# EAGLE schematic cpu-68000 (EAGLE 9.5.2)

## Sheet 1 of 4: CPU
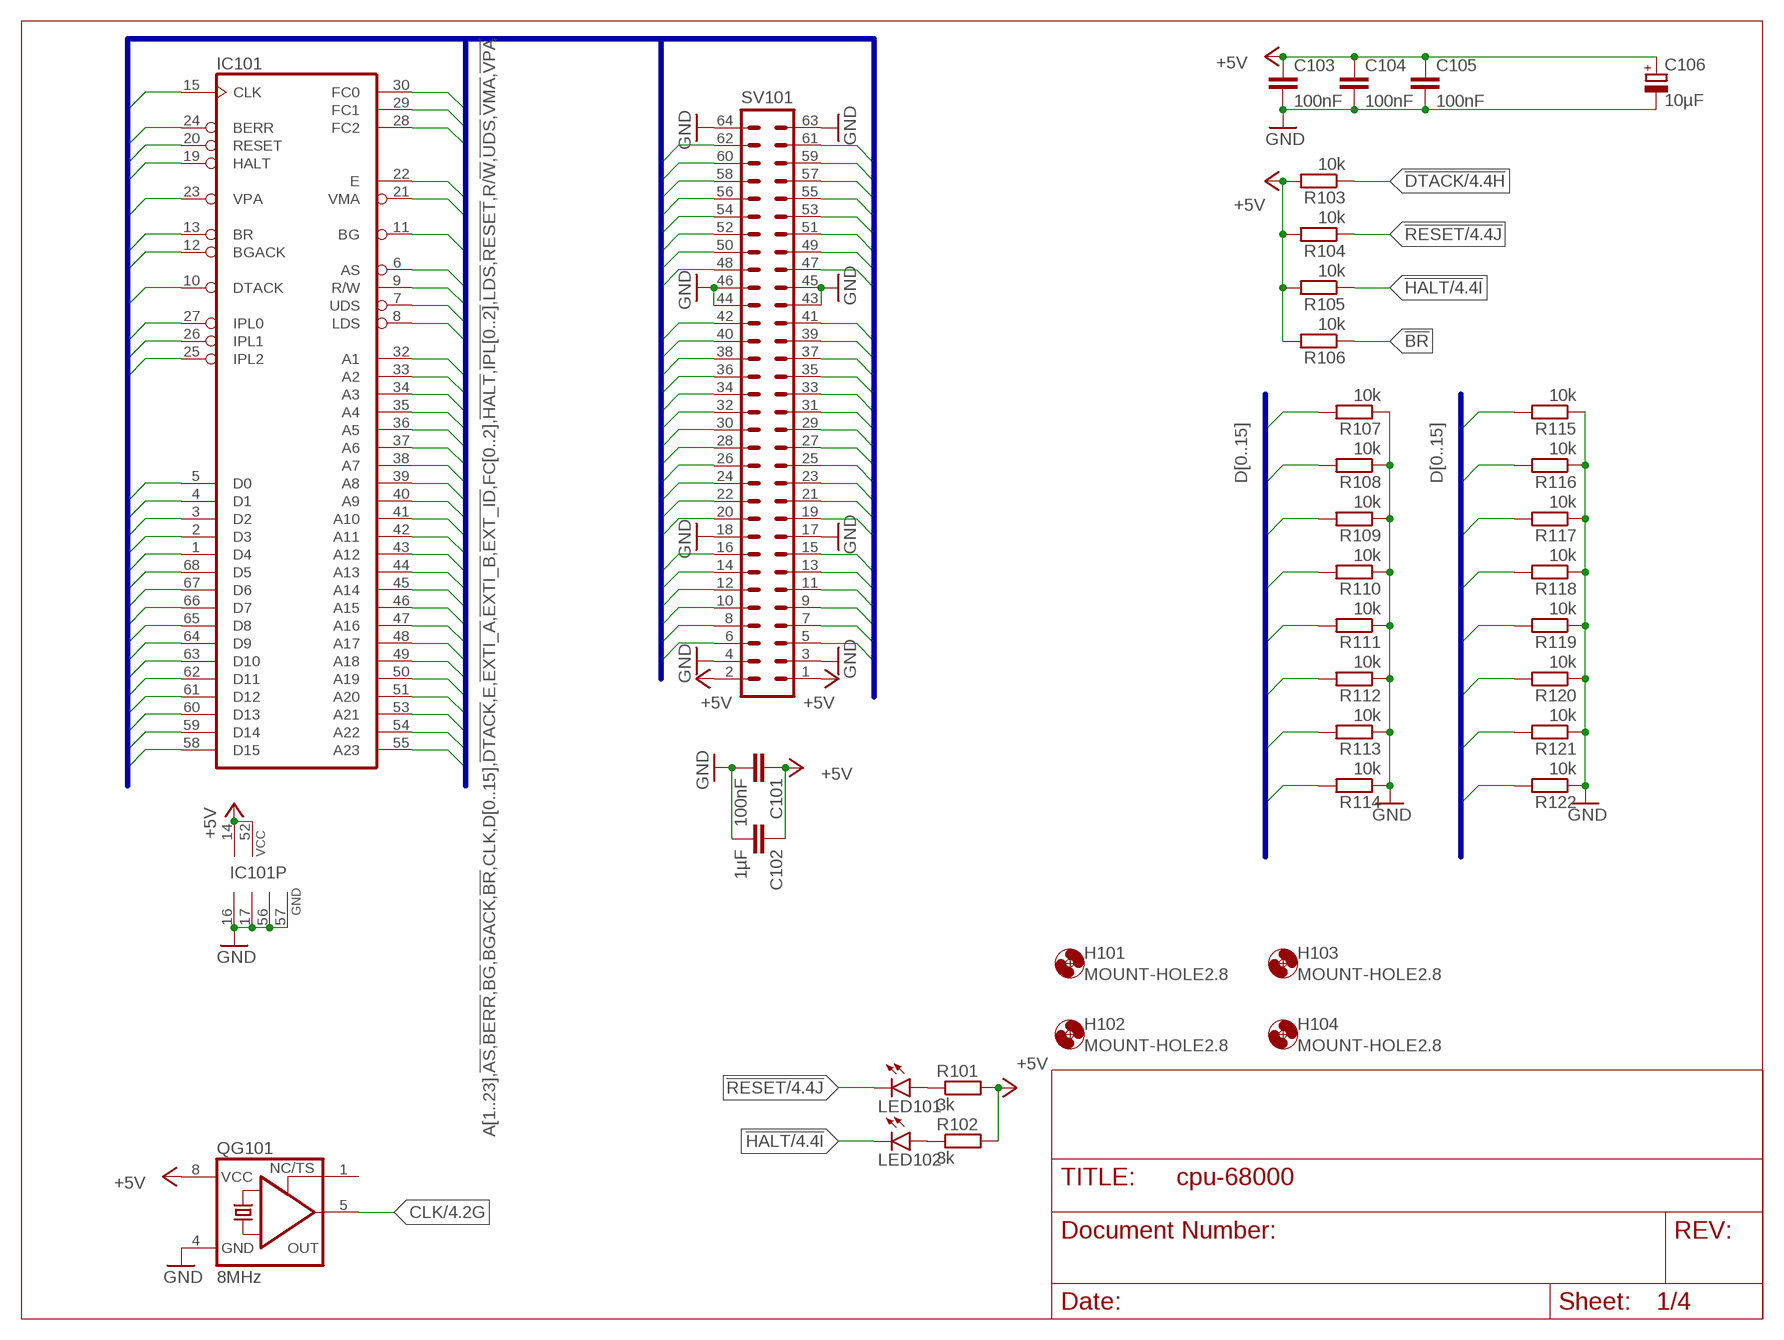
[diagram p0: schematic, sheet 1]

### Parts
C101  100nF  C-EUC0805  [C0805]
C102  1µF  C-EUC0805  [C0805]
C103  100nF  C-EUC0805  [C0805]
C104  100nF  C-EUC0805  [C0805]
C105  100nF  C-EUC0805  [C0805]
C106  10µF  CPOL-EUSMCB  [SMC_B]
H101  MOUNT-HOLE2.8  [2,8]
H102  MOUNT-HOLE2.8  [2,8]
H103  MOUNT-HOLE2.8  [2,8]
H104  MOUNT-HOLE2.8  [2,8]
IC101  MC68000FN-SOC  [PLCC68SOCK]
LED101  LEDCHIPLED_1206  [CHIPLED_1206]
LED102  LEDCHIPLED_1206  [CHIPLED_1206]
QG101  8MHz  XO-8  [DIL08S]
R101  3k  R-EU_R2012  [R2012]
R102  3k  R-EU_R2012  [R2012]
R103  10k  R-EU_R2012  [R2012]
R104  10k  R-EU_R2012  [R2012]
R105  10k  R-EU_R2012  [R2012]
R106  10k  R-EU_R2012  [R2012]
R107  10k  R-EU_R2012  [R2012]
R108  10k  R-EU_R2012  [R2012]
R109  10k  R-EU_R2012  [R2012]
R110  10k  R-EU_R2012  [R2012]
R111  10k  R-EU_R2012  [R2012]
R112  10k  R-EU_R2012  [R2012]
R113  10k  R-EU_R2012  [R2012]
R114  10k  R-EU_R2012  [R2012]
R115  10k  R-EU_R2012  [R2012]
R116  10k  R-EU_R2012  [R2012]
R117  10k  R-EU_R2012  [R2012]
R118  10k  R-EU_R2012  [R2012]
R119  10k  R-EU_R2012  [R2012]
R120  10k  R-EU_R2012  [R2012]
R121  10k  R-EU_R2012  [R2012]
R122  10k  R-EU_R2012  [R2012]
SV101  ML64L  [ML64L]

### Nets
!AS: IC101.6(AS) SV101.13 ; also sheet 4
!BERR: IC101.24(BERR) ; also sheet 4
!BG: IC101.11(BG) SV101.9
!BGACK: IC101.12(BGACK) SV101.8
!BR: IC101.13(BR) R106.1 SV101.7
!DTACK: IC101.10(DTACK) R103.1 SV101.10 ; also sheet 3,4
!EXT_ID: SV101.41 ; also sheet 3
!EXTI_A: SV101.16 ; also sheet 4
!EXTI_B: SV101.15 ; also sheet 4
!HALT: IC101.19(HALT) LED102.C R105.1 SV101.5 ; also sheet 4
!IPL0: IC101.27(IPL0) ; also sheet 4
!IPL1: IC101.26(IPL1) ; also sheet 4
!IPL2: IC101.25(IPL2) ; also sheet 4
!LDS: IC101.8(LDS) SV101.11 ; also sheet 4
!RESET: IC101.20(RESET) LED101.C R104.1 SV101.6 ; also sheet 3,4
!UDS: IC101.7(UDS) SV101.14 ; also sheet 4
!VMA: IC101.21(VMA)
!VPA: IC101.23(VPA) ; also sheet 4
+5V: C101.1 C102.1 C103.1 C104.1 C105.1 C106.+ IC101.14(VCC) IC101.52(VCC) QG101.8(VCC) R101.2 R102.2 R103.2 R104.2 R105.2 R106.2 SV101.1 SV101.2 ; also sheet 2,3,4
A1: IC101.32(A1) SV101.20 ; also sheet 2,3
A2: IC101.33(A2) SV101.22 ; also sheet 2,3
A3: IC101.34(A3) SV101.19 ; also sheet 2,3
A4: IC101.35(A4) SV101.24 ; also sheet 2,3
A5: IC101.36(A5) SV101.21 ; also sheet 2,3
A6: IC101.37(A6) SV101.23 ; also sheet 2,3
A7: IC101.38(A7) SV101.26 ; also sheet 2,3
A8: IC101.39(A8) SV101.25 ; also sheet 2,3
A9: IC101.40(A9) SV101.28 ; also sheet 2,3
A10: IC101.41(A10) SV101.27 ; also sheet 2,3
A11: IC101.42(A11) SV101.30 ; also sheet 2,3
A12: IC101.43(A12) SV101.29 ; also sheet 2,3
A13: IC101.44(A13) SV101.31 ; also sheet 2,3
A14: IC101.45(A14) SV101.32 ; also sheet 2,3
A15: IC101.46(A15) SV101.33 ; also sheet 2,3,4
A16: IC101.47(A16) SV101.34 ; also sheet 2
A17: IC101.48(A17) SV101.36 ; also sheet 2
A18: IC101.49(A18) SV101.35 ; also sheet 2
A19: IC101.50(A19) SV101.38 ; also sheet 2,4
A20: IC101.51(A20) SV101.37 ; also sheet 4
A21: IC101.53(A21) SV101.40 ; also sheet 4
A22: IC101.54(A22) SV101.39 ; also sheet 4
A23: IC101.55(A23) SV101.42 ; also sheet 4
CLK: IC101.15(CLK) QG101.5(OUT) ; also sheet 4
D0: IC101.5(D0) R107.2 SV101.62 ; also sheet 2,3
D1: IC101.4(D1) R108.2 SV101.60 ; also sheet 2,3
D2: IC101.3(D2) R109.2 SV101.58 ; also sheet 2,3
D3: IC101.2(D3) R110.2 SV101.56 ; also sheet 2,3
D4: IC101.1(D4) R111.2 SV101.54 ; also sheet 2,3
D5: IC101.68(D5) R112.2 SV101.52 ; also sheet 2,3
D6: IC101.67(D6) R113.2 SV101.50 ; also sheet 2,3
D7: IC101.66(D7) R114.2 SV101.48 ; also sheet 2,3
D8: IC101.65(D8) R115.2 SV101.57 ; also sheet 2
D9: IC101.64(D9) R116.2 SV101.59 ; also sheet 2
D10: IC101.63(D10) R117.2 SV101.61 ; also sheet 2
D11: IC101.62(D11) R118.2 SV101.55 ; also sheet 2
D12: IC101.61(D12) R119.2 SV101.53 ; also sheet 2
D13: IC101.60(D13) R120.2 SV101.51 ; also sheet 2
D14: IC101.59(D14) R121.2 SV101.49 ; also sheet 2
D15: IC101.58(D15) R122.2 SV101.47 ; also sheet 2
E: IC101.22(E) ; also sheet 4
FC0: IC101.30(FC0) ; also sheet 4
FC1: IC101.29(FC1) ; also sheet 4
FC2: IC101.28(FC2) ; also sheet 4
GND: C101.2 C102.2 C103.2 C104.2 C105.2 C106.- IC101.16(GND) IC101.17(GND) IC101.56(GND) IC101.57(GND) QG101.4(GND) R107.1 R108.1 R109.1 R110.1 R111.1 R112.1 R113.1 R114.1 R115.1 R116.1 R117.1 R118.1 R119.1 R120.1 R121.1 R122.1 SV101.3 SV101.4 SV101.17 SV101.18 SV101.43 SV101.44 SV101.45 SV101.46 SV101.63 SV101.64 ; also sheet 2,3,4
N$18: LED101.A R101.1
N$19: LED102.A R102.1
R/!W!: IC101.9(R/W) SV101.12 ; also sheet 4
Unconnected: QG101.1(TS)

### Buses
A[1..23],!AS,!BERR,!BG,!BGACK,!BR,CLK,D[0..15],!DTACK,E,!EXTI_A,!EXTI_B,!EXT_ID,FC[0..2],!HALT,!IPL[0..2],!LDS,!RESET,R/!W!,!UDS,!VMA,!VPA
D[0..15]

## Sheet 2 of 4: RAM, ROM
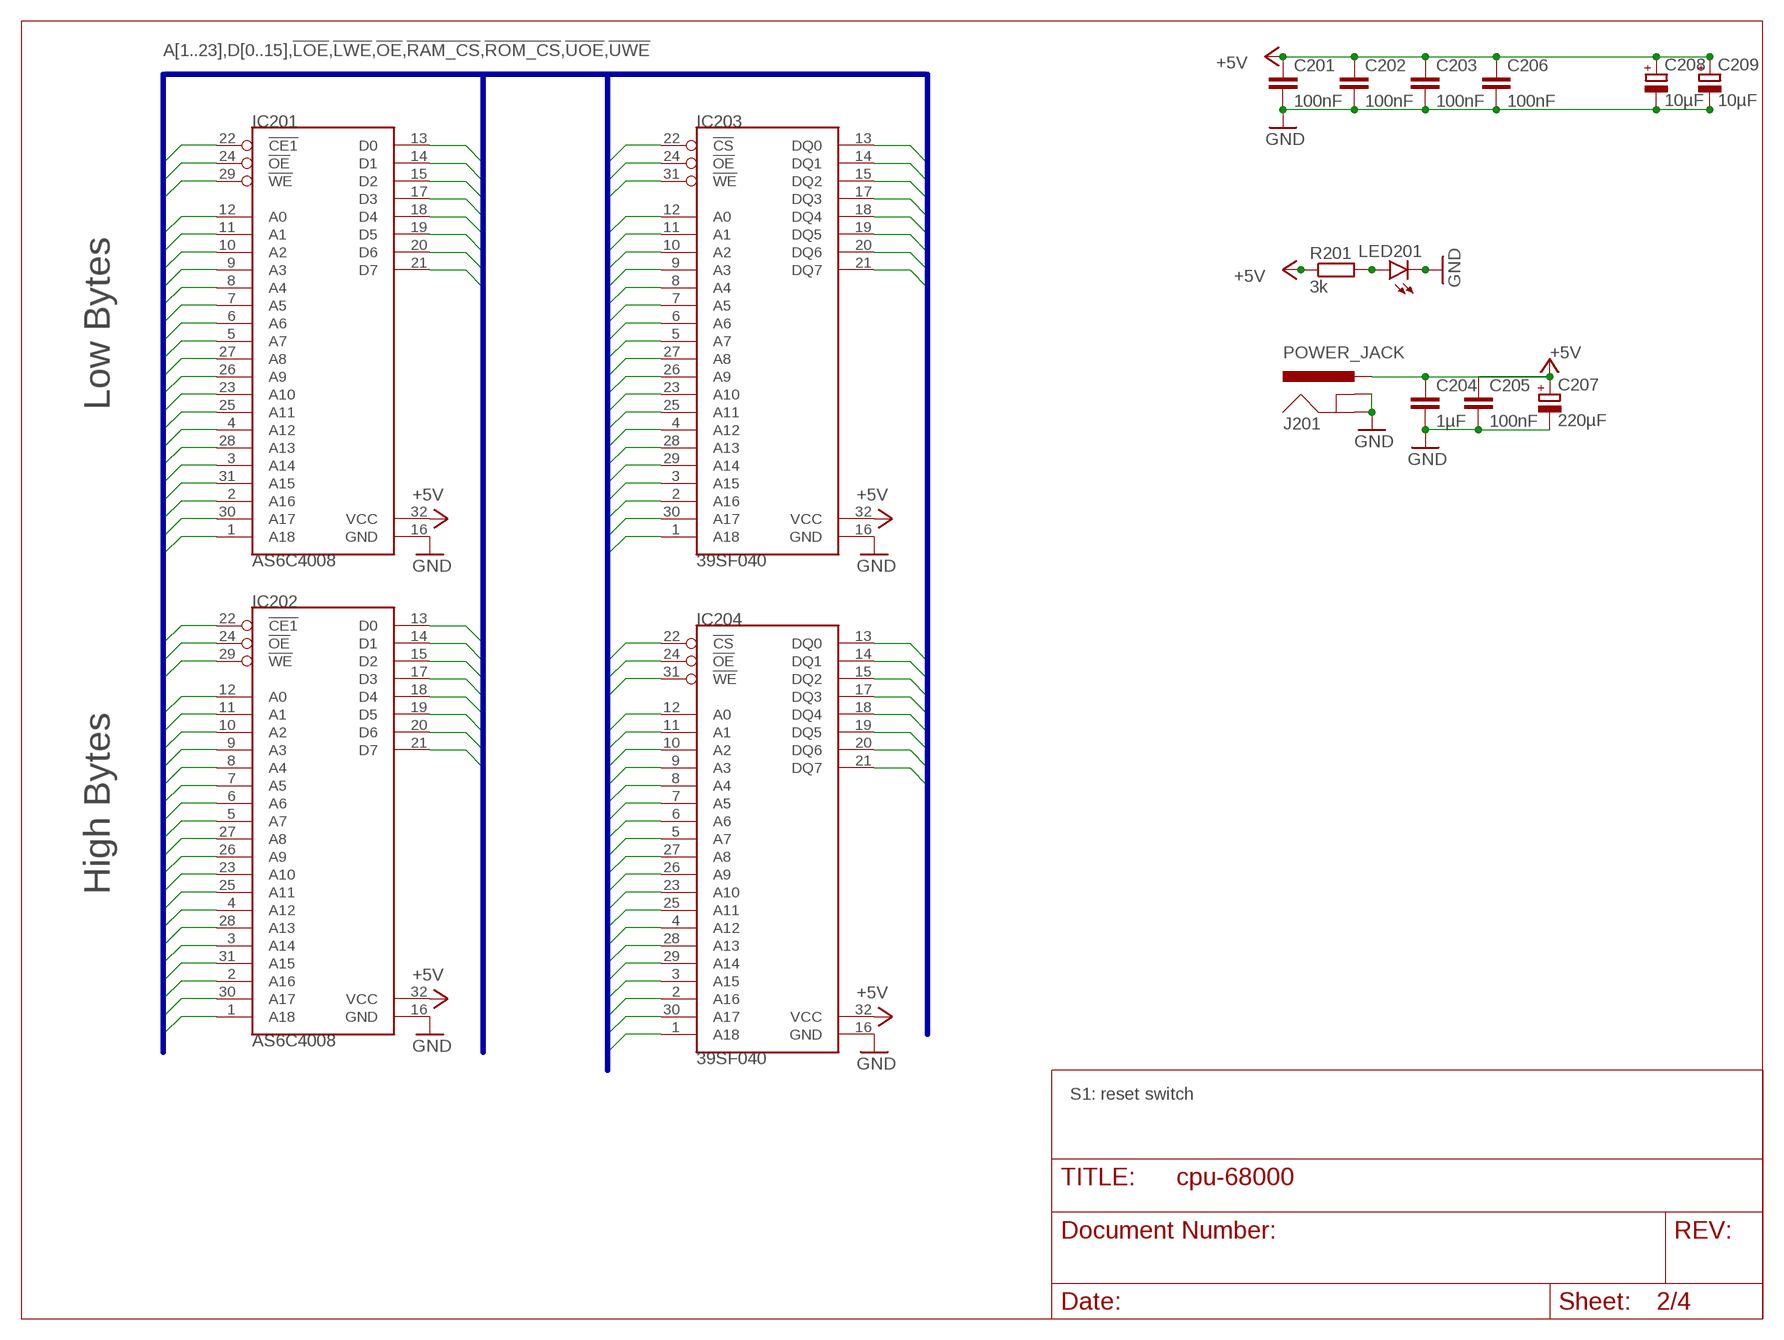
[diagram p1: schematic, sheet 2]

### Parts
C201  100nF  C-EUC0805  [C0805]
C202  100nF  C-EUC0805  [C0805]
C203  100nF  C-EUC0805  [C0805]
C204  1µF  C-EUC0805  [C0805]
C205  100nF  C-EUC0805  [C0805]
C206  100nF  C-EUC0805  [C0805]
C207  220µF  CPOL-EUE2.5-7  [E2,5-7]
C208  10µF  CPOL-EUSMCB  [SMC_B]
C209  10µF  CPOL-EUSMCB  [SMC_B]
IC201  AS6C4008  [DIL32]
IC202  AS6C4008  [DIL32]
IC203  39SF040  SST39SF0X0PDIP32  [DIL32]
IC204  39SF040  SST39SF0X0PDIP32  [DIL32]
J201  POWER_JACK  [POWER_JACK_PTH]
LED201  LEDCHIPLED_1206  [CHIPLED_1206]
R201  3k  R-EU_R2012  [R2012]

### Nets
!LOE: IC201.24(!OE) IC203.24(!OE) ; also sheet 3,4
!LWE: IC201.29(!WE) IC203.31(!WE) ; also sheet 3,4
!RAM_CS: IC201.22(!CE1) IC202.22(!CE1) ; also sheet 4
!ROM_CS: IC203.22(!CS) IC204.22(!CS) ; also sheet 4
!UOE: IC202.24(!OE) IC204.24(!OE) ; also sheet 4
!UWE: IC202.29(!WE) IC204.31(!WE) ; also sheet 4
+5V: C201.1 C202.1 C203.1 C204.1 C205.1 C206.1 C207.+ C208.+ C209.+ IC201.32(VCC) IC202.32(VCC) IC203.32(VCC) IC204.32(VCC) J201.PWR R201.1 ; also sheet 1,3,4
A1: IC201.12(A0) IC202.12(A0) IC203.12(A0) IC204.12(A0) ; also sheet 1,3
A2: IC201.11(A1) IC202.11(A1) IC203.11(A1) IC204.11(A1) ; also sheet 1,3
A3: IC201.10(A2) IC202.10(A2) IC203.10(A2) IC204.10(A2) ; also sheet 1,3
A4: IC201.9(A3) IC202.9(A3) IC203.9(A3) IC204.9(A3) ; also sheet 1,3
A5: IC201.8(A4) IC202.8(A4) IC203.8(A4) IC204.8(A4) ; also sheet 1,3
A6: IC201.7(A5) IC202.7(A5) IC203.7(A5) IC204.7(A5) ; also sheet 1,3
A7: IC201.6(A6) IC202.6(A6) IC203.6(A6) IC204.6(A6) ; also sheet 1,3
A8: IC201.5(A7) IC202.5(A7) IC203.5(A7) IC204.5(A7) ; also sheet 1,3
A9: IC201.27(A8) IC202.27(A8) IC203.27(A8) IC204.27(A8) ; also sheet 1,3
A10: IC201.26(A9) IC202.26(A9) IC203.26(A9) IC204.26(A9) ; also sheet 1,3
A11: IC201.23(A10) IC202.23(A10) IC203.23(A10) IC204.23(A10) ; also sheet 1,3
A12: IC201.25(A11) IC202.25(A11) IC203.25(A11) IC204.25(A11) ; also sheet 1,3
A13: IC201.4(A12) IC202.4(A12) IC203.4(A12) IC204.4(A12) ; also sheet 1,3
A14: IC201.28(A13) IC202.28(A13) IC203.28(A13) IC204.28(A13) ; also sheet 1,3
A15: IC201.3(A14) IC202.3(A14) IC203.29(A14) IC204.29(A14) ; also sheet 1,3,4
A16: IC201.31(A15) IC202.31(A15) IC203.3(A15) IC204.3(A15) ; also sheet 1
A17: IC201.2(A16) IC202.2(A16) IC203.2(A16) IC204.2(A16) ; also sheet 1
A18: IC201.30(A17) IC202.30(A17) IC203.30(A17) IC204.30(A17) ; also sheet 1
A19: IC201.1(A18) IC202.1(A18) IC203.1(A18) IC204.1(A18) ; also sheet 1,4
D0: IC201.13(D0) IC203.13(DQ0) ; also sheet 1,3
D1: IC201.14(D1) IC203.14(DQ1) ; also sheet 1,3
D2: IC201.15(D2) IC203.15(DQ2) ; also sheet 1,3
D3: IC201.17(D3) IC203.17(DQ3) ; also sheet 1,3
D4: IC201.18(D4) IC203.18(DQ4) ; also sheet 1,3
D5: IC201.19(D5) IC203.19(DQ5) ; also sheet 1,3
D6: IC201.20(D6) IC203.20(DQ6) ; also sheet 1,3
D7: IC201.21(D7) IC203.21(DQ7) ; also sheet 1,3
D8: IC202.13(D0) IC204.13(DQ0) ; also sheet 1
D9: IC202.14(D1) IC204.14(DQ1) ; also sheet 1
D10: IC202.15(D2) IC204.15(DQ2) ; also sheet 1
D11: IC202.17(D3) IC204.17(DQ3) ; also sheet 1
D12: IC202.18(D4) IC204.18(DQ4) ; also sheet 1
D13: IC202.19(D5) IC204.19(DQ5) ; also sheet 1
D14: IC202.20(D6) IC204.20(DQ6) ; also sheet 1
D15: IC202.21(D7) IC204.21(DQ7) ; also sheet 1
GND: C201.2 C202.2 C203.2 C204.2 C205.2 C206.2 C207.- C208.- C209.- IC201.16(GND) IC202.16(GND) IC203.16(GND) IC204.16(GND) J201.GND J201.GNDBREAK LED201.C ; also sheet 1,3,4
N$4: LED201.A R201.2

### Buses
A[1..23],D[0..15],!LOE,!LWE,!OE,!RAM_CS,!ROM_CS,!UOE,!UWE

### Notes on the sheet
- Low Bytes
- High Bytes
- S1: reset switch

## Sheet 3 of 4: Peripherals (DUART, RTC)
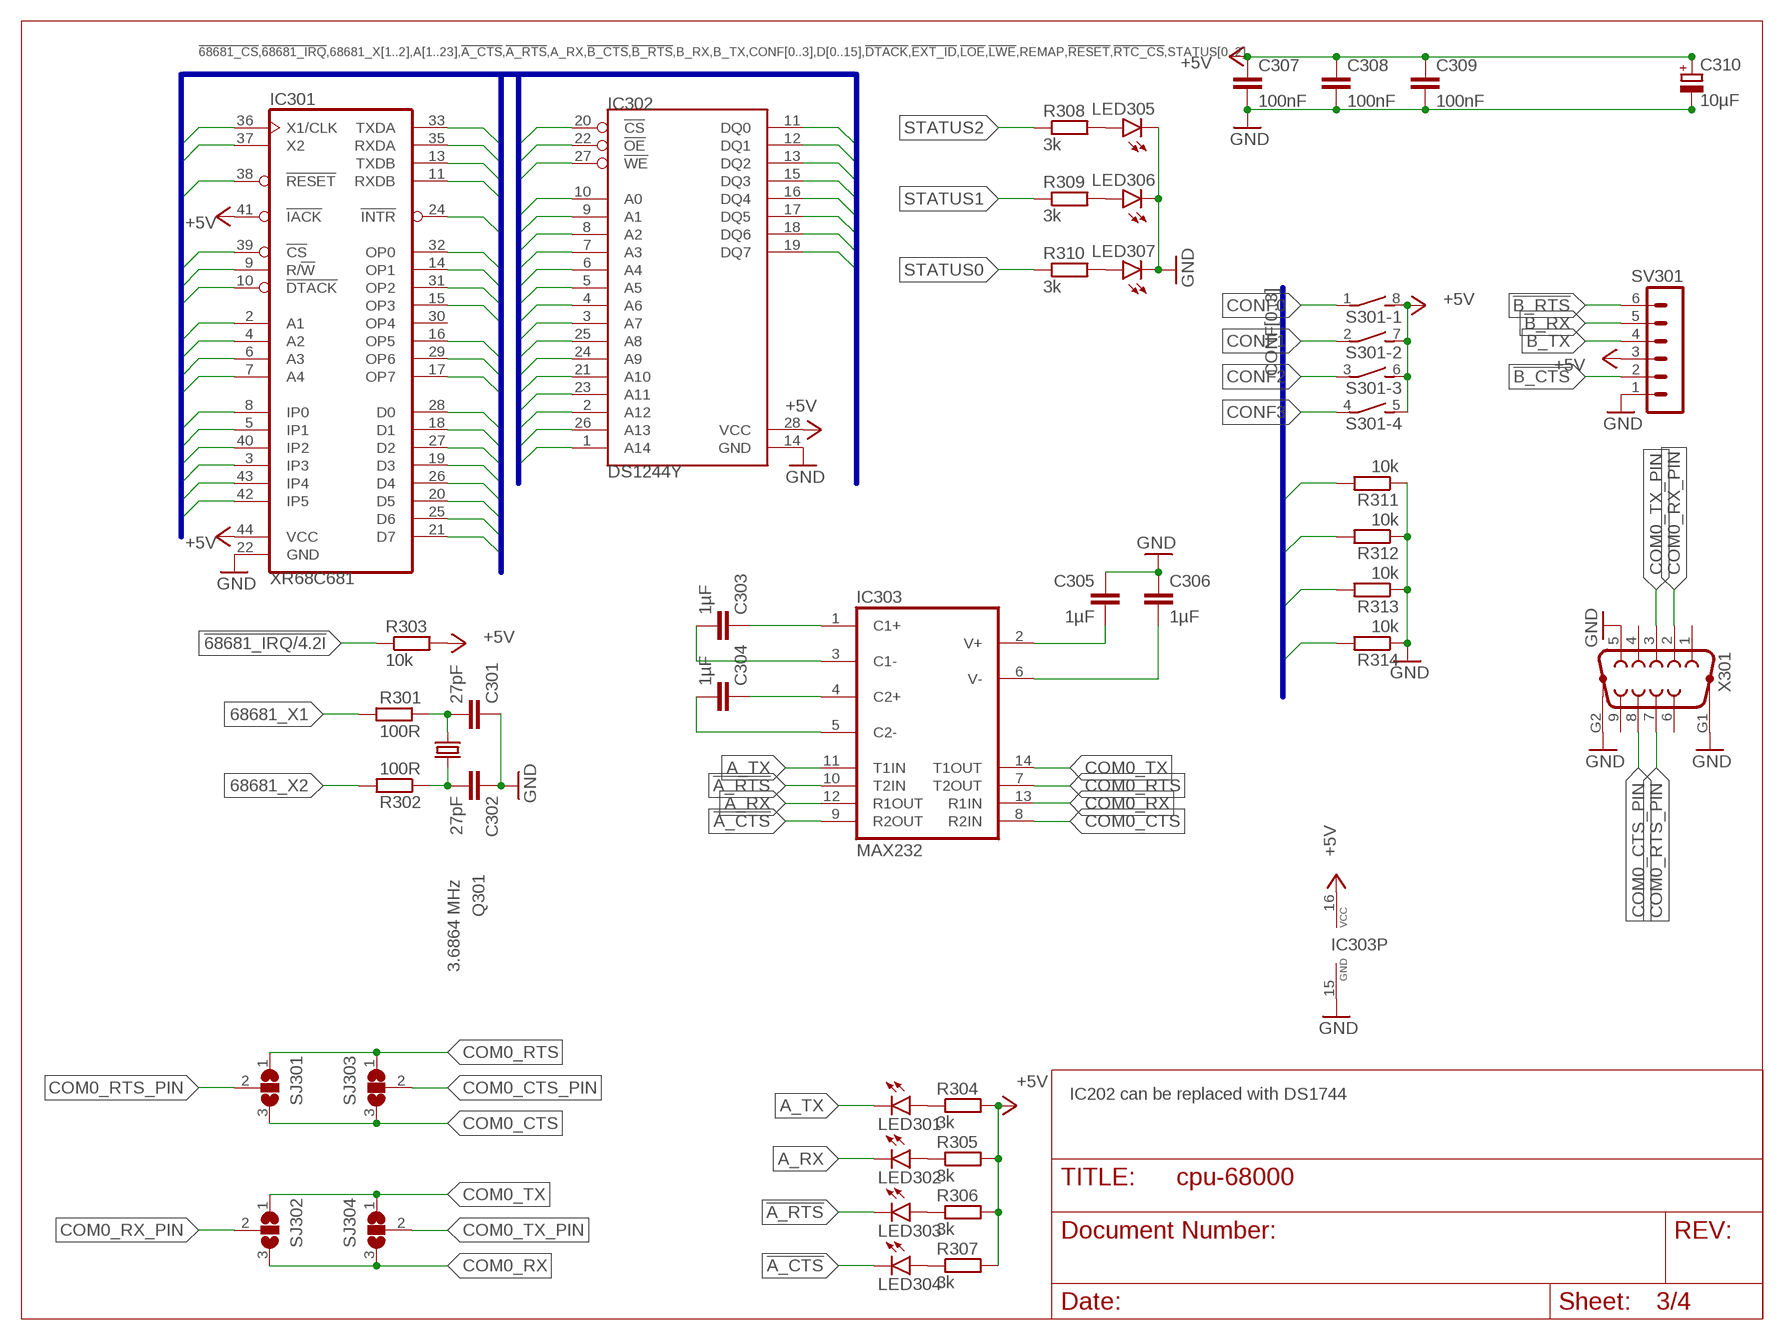
[diagram p2: schematic, sheet 3]

### Parts
C301  27pF  C-EUC0805  [C0805]
C302  27pF  C-EUC0805  [C0805]
C303  1µF  C-EUC0805  [C0805]
C304  1µF  C-EUC0805  [C0805]
C305  1µF  C-EUC0805  [C0805]
C306  1µF  C-EUC0805  [C0805]
C307  100nF  C-EUC0805  [C0805]
C308  100nF  C-EUC0805  [C0805]
C309  100nF  C-EUC0805  [C0805]
C310  10µF  CPOL-EUSMCB  [SMC_B]
IC301  XR68C681  MC68681PLCC44-SOCKET  [PLCC-S44]
IC302  DS1244Y  DS1244EDIP-28  [DIL28-6]
IC303  MAX232  [DIL16]
LED301  LEDCHIPLED_1206  [CHIPLED_1206]
LED302  LEDCHIPLED_1206  [CHIPLED_1206]
LED303  LEDCHIPLED_1206  [CHIPLED_1206]
LED304  LEDCHIPLED_1206  [CHIPLED_1206]
LED305  LEDCHIPLED_1206  [CHIPLED_1206]
LED306  LEDCHIPLED_1206  [CHIPLED_1206]
LED307  LEDCHIPLED_1206  [CHIPLED_1206]
Q301  3.6864 MHz  CRYSTALHC49S  [HC49/S]
R301  100R  R-EU_R2012  [R2012]
R302  100R  R-EU_R2012  [R2012]
R303  10k  R-EU_R2012  [R2012]
R304  3k  R-EU_R2012  [R2012]
R305  3k  R-EU_R2012  [R2012]
R306  3k  R-EU_R2012  [R2012]
R307  3k  R-EU_R2012  [R2012]
R308  3k  R-EU_R2012  [R2012]
R309  3k  R-EU_R2012  [R2012]
R310  3k  R-EU_R2012  [R2012]
R311  10k  R-EU_R2012  [R2012]
R312  10k  R-EU_R2012  [R2012]
R313  10k  R-EU_R2012  [R2012]
R314  10k  R-EU_R2012  [R2012]
S301  DIP04S  [DIP04S]
SJ301  SJ2WW  [SJ_2W]
SJ302  SJ2WW  [SJ_2W]
SJ303  SJ2WW  [SJ_2W]
SJ304  SJ2WW  [SJ_2W]
SV301  MA06-1  [MA06-1]
X301  F09HP  [F09HP]

### Nets
68681_X1: IC301.36(X1/CLK) R301.2
68681_X2: IC301.37(X2) R302.2
!68681_CS: IC301.39(!CS) ; also sheet 4
!68681_IRQ: IC301.24(!INTR) R303.1 ; also sheet 4
!A_CTS: IC301.8(IP0) IC303.9(R2OUT) LED304.C
!A_RTS: IC301.32(OP0) IC303.10(T2IN) LED303.C
!B_CTS: IC301.5(IP1) SV301.2
!B_RTS: IC301.14(OP1) SV301.6
!DTACK: IC301.10(!DTACK) ; also sheet 1,4
!EXT_ID: IC301.29(OP6) ; also sheet 1
!LOE: IC302.22(!OE) ; also sheet 2,4
!LWE: IC301.9(R/!W) IC302.27(!WE) ; also sheet 2,4
!RESET: IC301.38(!RESET) ; also sheet 1,4
!RTC_CS: IC302.20(!CS) ; also sheet 4
+5V: C307.1 C308.1 C309.1 C310.+ IC301.41(!IACK) IC301.44(VCC) IC302.28(VCC) IC303.16(VCC) R303.2 R304.2 R305.2 R306.2 R307.2 S301.5 S301.6 S301.7 S301.8 SV301.3 ; also sheet 1,2,4
A1: IC301.2(A1) IC302.10(A0) ; also sheet 1,2
A2: IC301.4(A2) IC302.9(A1) ; also sheet 1,2
A3: IC301.6(A3) IC302.8(A2) ; also sheet 1,2
A4: IC301.7(A4) IC302.7(A3) ; also sheet 1,2
A5: IC302.6(A4) ; also sheet 1,2
A6: IC302.5(A5) ; also sheet 1,2
A7: IC302.4(A6) ; also sheet 1,2
A8: IC302.3(A7) ; also sheet 1,2
A9: IC302.25(A8) ; also sheet 1,2
A10: IC302.24(A9) ; also sheet 1,2
A11: IC302.21(A10) ; also sheet 1,2
A12: IC302.23(A11) ; also sheet 1,2
A13: IC302.2(A12) ; also sheet 1,2
A14: IC302.26(A13) ; also sheet 1,2
A15: IC302.1(A14) ; also sheet 1,2,4
A_RX: IC301.35(RXDA) IC303.12(R1OUT) LED302.C
A_TX: IC301.33(TXDA) IC303.11(T1IN) LED301.C
B_RX: IC301.11(RXDB) SV301.5
B_TX: IC301.13(TXDB) SV301.4
COM0_CTS: IC303.8(R2IN) SJ301.3 SJ303.3
COM0_CTS_PIN: SJ303.2 X301.8
COM0_RTS: IC303.7(T2OUT) SJ301.1 SJ303.1
COM0_RTS_PIN: SJ301.2 X301.7
COM0_RX: IC303.13(R1IN) SJ302.3 SJ304.3
COM0_RX_PIN: SJ302.2 X301.2
COM0_TX: IC303.14(T1OUT) SJ302.1 SJ304.1
COM0_TX_PIN: SJ304.2 X301.3
CONF0: IC301.40(IP2) R311.2 S301.1
CONF1: IC301.43(IP4) R312.2 S301.2
CONF2: IC301.42(IP5) R313.2 S301.3
CONF3: IC301.3(IP3) R314.2 S301.4
D0: IC301.28(D0) IC302.11(DQ0) ; also sheet 1,2
D1: IC301.18(D1) IC302.12(DQ1) ; also sheet 1,2
D2: IC301.27(D2) IC302.13(DQ2) ; also sheet 1,2
D3: IC301.19(D3) IC302.15(DQ3) ; also sheet 1,2
D4: IC301.26(D4) IC302.16(DQ4) ; also sheet 1,2
D5: IC301.20(D5) IC302.17(DQ5) ; also sheet 1,2
D6: IC301.25(D6) IC302.18(DQ6) ; also sheet 1,2
D7: IC301.21(D7) IC302.19(DQ7) ; also sheet 1,2
GND: C301.1 C302.1 C305.1 C306.1 C307.2 C308.2 C309.2 C310.- IC301.22(GND) IC302.14(GND) IC303.15(GND) LED305.C LED306.C LED307.C R311.1 R312.1 R313.1 R314.1 SV301.1 X301.5 X301.G1 X301.G2 ; also sheet 1,2,4
N$1: C305.2 IC303.2(V+)
N$2: C301.2 Q301.1 R301.1
N$3: C302.2 Q301.2 R302.1
N$7: LED306.A R309.2
N$9: LED307.A R310.2
N$10: LED305.A R308.2
N$12: LED301.A R304.1
N$14: LED302.A R305.1
N$15: LED303.A R306.1
N$16: LED304.A R307.1
N$17: C306.2 IC303.6(V-)
N$24: C304.1 IC303.4(C2+)
N$25: C303.1 IC303.1(C1+)
N$26: C303.2 IC303.3(C1-)
N$27: C304.2 IC303.5(C2-)
REMAP: IC301.31(OP2) ; also sheet 4
STATUS0: IC301.16(OP5) R310.1
STATUS1: IC301.17(OP7) R309.1
STATUS2: IC301.15(OP3) R308.1
Unconnected: IC301.30(OP4) X301.1 X301.4 X301.6 X301.9

### Buses
!68681_CS,!68681_IRQ,68681_X[1..2],A[1..23],!A_CTS,!A_RTS,A_RX,!B_CTS,!B_RTS,B_RX,B_TX,CONF[0..3],D[0..15],!DTACK,!EXT_ID,!LOE,!LWE,REMAP,!RESET,!RTC_CS,STATUS[0..2]
CONF[0..3]

### Notes on the sheet
- IC202 can be replaced with DS1744

## Sheet 4 of 4: Supporting Logic
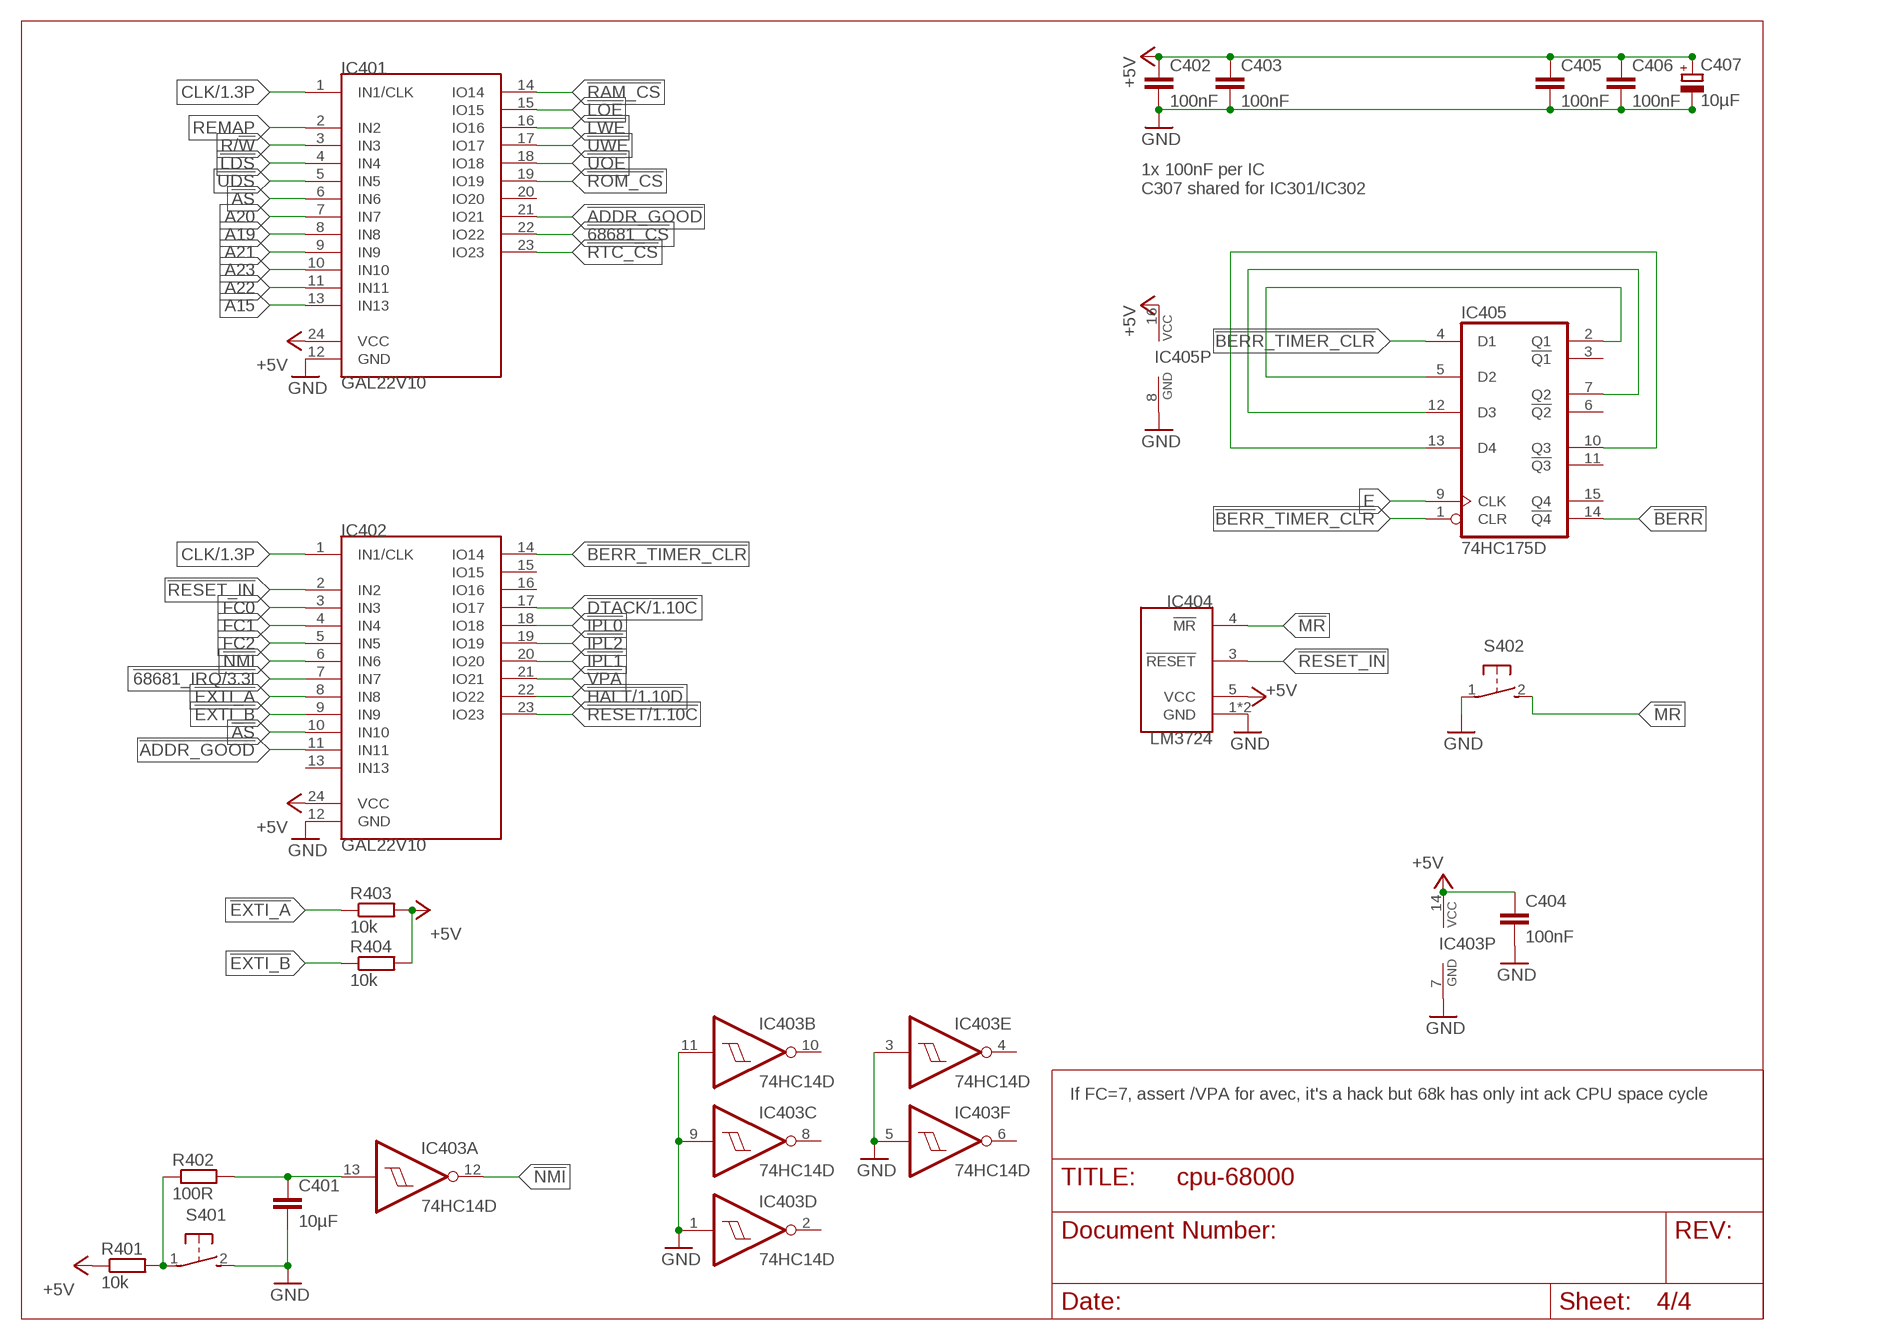
[diagram p3: schematic, sheet 4]

### Parts
C401  10µF  C-EUC0805  [C0805]
C402  100nF  C-EUC0805  [C0805]
C403  100nF  C-EUC0805  [C0805]
C404  100nF  C-EUC0805  [C0805]
C405  100nF  C-EUC0805  [C0805]
C406  100nF  C-EUC0805  [C0805]
C407  10µF  CPOL-EUSMCB  [SMC_B]
IC401  GAL22V10  GAL22V10DIP24  [DIL24S]
IC402  GAL22V10  GAL22V10DIP24  [DIL24S]
IC403  74HC14D  [SO14]
IC404  LM3724  [SOT23-5]
IC405  74HC175D  [SO16]
R401  10k  R-EU_R2012  [R2012]
R402  100R  R-EU_R2012  [R2012]
R403  10k  R-EU_R2012  [R2012]
R404  10k  R-EU_R2012  [R2012]
S401  31-XX  [B3F-31XX]
S402  31-XX  [B3F-31XX]

### Nets
!68681_CS: IC401.22(IO22) ; also sheet 3
!68681_IRQ: IC402.7(IN7) ; also sheet 3
!ADDR_GOOD: IC401.21(IO21) IC402.11(IN11)
!AS: IC401.6(IN6) IC402.10(IN10) ; also sheet 1
!BERR: IC405.14(!Q4) ; also sheet 1
!BERR_TIMER_CLR: IC402.14(IO14) IC405.1(CLR) IC405.4(D1)
!DTACK: IC402.17(IO17) ; also sheet 1,3
!EXTI_A: IC402.8(IN8) R403.1 ; also sheet 1
!EXTI_B: IC402.9(IN9) R404.1 ; also sheet 1
!HALT: IC402.22(IO22) ; also sheet 1
!IPL0: IC402.18(IO18) ; also sheet 1
!IPL1: IC402.20(IO20) ; also sheet 1
!IPL2: IC402.19(IO19) ; also sheet 1
!LDS: IC401.4(IN4) ; also sheet 1
!LOE: IC401.15(IO15) ; also sheet 2,3
!LWE: IC401.16(IO16) ; also sheet 2,3
!MR: IC404.4(!MR) S402.2(S)
!NMI: IC402.6(IN6) IC403.12(A:O)
!RAM_CS: IC401.14(IO14) ; also sheet 2
!RESET: IC402.23(IO23) ; also sheet 1,3
!RESET_IN: IC402.2(IN2) IC404.3(!RESET)
!ROM_CS: IC401.19(IO19) ; also sheet 2
!RTC_CS: IC401.23(IO23) ; also sheet 3
!UDS: IC401.5(IN5) ; also sheet 1
!UOE: IC401.18(IO18) ; also sheet 2
!UWE: IC401.17(IO17) ; also sheet 2
!VPA: IC402.21(IO21) ; also sheet 1
+5V: C402.1 C403.1 C404.1 C405.1 C406.1 C407.+ IC401.24(VCC) IC402.24(VCC) IC403.14(P:VCC) IC404.5(VCC) IC405.16(VCC) R401.1 R403.2 R404.2 ; also sheet 1,2,3
A15: IC401.13(IN13) ; also sheet 1,2,3
A19: IC401.8(IN8) ; also sheet 1,2
A20: IC401.7(IN7) ; also sheet 1
A21: IC401.9(IN9) ; also sheet 1
A22: IC401.11(IN11) ; also sheet 1
A23: IC401.10(IN10) ; also sheet 1
CLK: IC401.1(IN1/CLK) IC402.1(IN1/CLK) ; also sheet 1
E: IC405.9(CLK) ; also sheet 1
FC0: IC402.3(IN3) ; also sheet 1
FC1: IC402.4(IN4) ; also sheet 1
FC2: IC402.5(IN5) ; also sheet 1
GND: C401.2 C402.2 C403.2 C404.2 C405.2 C406.2 C407.- IC401.12(GND) IC402.12(GND) IC403.1(D:I) IC403.3(E:I) IC403.5(F:I) IC403.7(P:GND) IC403.9(C:I) IC403.11(B:I) IC404.1(GND) IC404.2(GND) IC405.8(GND) S401.2(S) S402.1(P) ; also sheet 1,2,3
N$5: IC405.2(Q1) IC405.5(D2)
N$6: IC405.7(Q2) IC405.12(D3)
N$8: IC405.10(Q3) IC405.13(D4)
N$11: R401.2 R402.1 S401.1(P)
N$13: C401.1 IC403.13(A:I) R402.2
R/!W!: IC401.3(IN3) ; also sheet 1
REMAP: IC401.2(IN2) ; also sheet 3
Unconnected: IC401.20(IO20) IC402.13(IN13) IC402.15(IO15) IC402.16(IO16) IC403.2(D:O) IC403.4(E:O) IC403.6(F:O) IC403.8(C:O) IC403.10(B:O) IC405.3(!Q1) IC405.6(!Q2) IC405.11(!Q3) IC405.15(Q4)

### Notes on the sheet
- 1x 100nF per IC
  C307 shared for IC301/IC302
- If FC=7, assert /VPA for avec, it's a hack but 68k has only int ack CPU space cycle

## Library data of the parts
C101 C103-C105 C201-C203 C205 C206 C307-C309 C402-C406 = rcl:C-EU: CAPACITOR, European symbol; MOUSER: 710-885012207072; SPICEPREFIX: C
C102 C303-C306 = rcl:C-EU: CAPACITOR, European symbol; MOUSER: 710-885012207078; SPICEPREFIX: C
C106 C208 C209 C310 C407 = rcl:CPOL-EU: POLARIZED CAPACITOR, European symbol; MOUSER: 581-TAJB106K020RNJV; SPICEPREFIX: C
C204 = rcl:C-EU: CAPACITOR, European symbol; MOUSER: 710-885012107015; SPICEPREFIX: C
C207 = rcl:CPOL-EU: POLARIZED CAPACITOR, European symbol; MOUSER: 710-860020373010; SPICEPREFIX: C
C301 C302 = rcl:C-EU: CAPACITOR, European symbol; MOUSER: 80-C0805C270K5HACTU; SPICEPREFIX: C
C401 = rcl:C-EU: CAPACITOR, European symbol; MOUSER: 791-0805F106Z100CT; SPICEPREFIX: C
H101-H104 = holes:MOUNT-HOLE: MOUNTING HOLE with drill center marker
IC101 = 68komputer:MC68000FN: 68000/68010 Processor 68000 User Manual <https://www.nxp.com/docs/en/reference-manual/MC68000UM.pdf> Based on MC68901FN from micro-mc68000.lbr; MOUSER_SOCKET: 940-44-068-24-000000; OC_FARNELL: unknown; OC_NEWARK: unknown
IC201 IC202 = 68komputer:AS6C4008: AS6C4008 – 512K x 8 Low Power SRAM Datasheet <https://www.mouser.com/datasheet/2/12/AS6C4008-1265427.pdf>; MOUSER: 913-AS6C4008-55PCN; MOUSER_SOCKET: 575-1144632
IC203 IC204 = 68komputer:SST39SF0X0: 1 Mbit / 2 Mbit / 4 Mbit Multi-Purpose Flash Datasheet <http://ww1.microchip.com/downloads/en/DeviceDoc/20005022C.pdf>; MOUSER: 804-39SF0407CPHE; MOUSER_SOCKET: 575-1144632
IC301 = 68komputer:MC68681: MC68681 Dual UART Datasheet <https://www.nxp.com/docs/en/data-sheet/SCC68681.pdf>; MOUSER: 701-XR68C681CJ-F; MOUSER_SOCKET: 940-44-044-24-000000
IC302 = Parts:DS1244: 256k NV SRAM with Phantom Clock Datasheet <https://datasheets.maximintegrated.com/en/ds/DS1244-DS1244P.pdf>; MOUSER: 700-DS1244Y-70; MOUSER_SOCKET: 575-1104762841001000
IC303 = maxim:MAX232: RS232 TRANSCEIVER; MF: MAXIM; MOUSER: 595-MAX232ECN; MOUSER_SOCKET: 575-1104731641001000; MPN: MAX232ACPE+; OC_FARNELL: 9723773; OC_NEWARK: 68K4544
IC401 IC402 = 68komputer:GAL22V10: GAL22V10D – Generic Array Logic Datasheet <http://web.mit.edu/6.115/www/document/gal22v10.pdf>; MOUSER_SOCKET: 575-1104732441001000
IC403 = 74xx-eu:74*14: Hex schmitt trigger INVERTER; MOUSER: 771-74HC14D-T
IC404 = 68komputer:LM3724: Low Power Reset IC / Voltage Supervisor with manual reset Datasheet <http://www.ti.com/lit/ds/symlink/lm3724.pdf>; MOUSER: 926-LM3724IM5463NOPB
IC405 = 74xx-eu:74*175: Qadruple D type FLIP FLOP, clear; MOUSER: 595-CD74HCT175M
J201 = SparkFun-Connectors:POWER_JACK: Power Jack Connector This is the standard 5.5mm barrel jack for power. The PTH is the most common, proven, reliable, footprint. The Slot footprint only works if the mill layer is transmitted to the PCB fab house so be warned. Here are the connectors we sell at SparkFun: DC Barrel Power Jack/Connector <https://www.sparkfun.com/products/119> (PRT-00119) DC Barrel Power Jack/Connector (SMD) <https://www.sparkfun.com/products/12748> (PRT-12748) DC Barrel Jack Adapter - Breadboard Compatible <https://www.sparkfun.com/products/10811> (PRT-10811) It is used on this SparkFun product (and many, many others): SparkFun RedBoard - Programmed with Arduino <https://www.sparkfun.com/products/12757> (DEV-12757) Also, if you need a mating power supply or connector, please check these out: Wall Adapter Power Supply - 9VDC 650mA <https://www.sparkfun.com/products/298> (TOL-00298) DC Barrel Jack Adapter - Male <https://www.sparkfun.com/products/10287> (PRT-10287); PROD_ID: CONN-08197
LED101 LED102 = led:LED: LED OSRAM: - CHIPLED LG R971, LG N971, LY N971, LG Q971, LY Q971, LO R971, LY R971 LH N974, LH R974 LS Q976, LO Q976, LY Q976 LO Q996 - Hyper CHIPLED LW Q18S LB Q993, LB Q99A, LB R99A - SideLED LS A670, LO A670, LY A670, LG A670, LP A670 LB A673, LV A673, LT A673, LW A673 LH A674 LY A675 LS A676, LA A676, LO A676, LY A676, LW A676 LS A679, LY A679, LG A679 - Hyper Micro SIDELED® LS Y876, LA Y876, LO Y876, LY Y876 LT Y87S - SmartLED LW L88C, LW L88S LB L89C, LB L89S, LG L890 LS L89K, LO L89K, LY L89K LS L896, LA L896, LO L896, LY L896 - TOPLED LS T670, LO T670, LY T670, LG T670, LP T670 LSG T670, LSP T670, LSY T670, LOP T670, LYG T670 LG T671, LOG T671, LSG T671 LB T673, LV T673, LT T673, LW T673 LH T674 LS T676, LA T676, LO T676, LY T676, LB T676, LH T676, LSB T676, LW T676 LB T67C, LV T67C, LT T67C, LS T67K, LO T67K, LY T67K, LW E67C LS E67B, LA E67B, LO E67B, LY E67B, LB E67C, LV E67C, LT E67C LW T67C LS T679, LY T679, LG T679 LS T770, LO T770, LY T770, LG T770, LP T770 LB T773, LV T773, LT T773, LW T773 LH T774 LS E675, LA E675, LY E675, LS T675 LS T776, LA T776, LO T776, LY T776, LB T776 LHGB T686 LT T68C, LB T68C - Hyper Mini TOPLED® LB M676 - Mini TOPLED Santana® LG M470 LS M47K, LO M47K, LY M47K Source: http://www.osram.convergy.de LUXEON: - LUMILED® LXK2-PW12-R00, LXK2-PW12-S00, LXK2-PW14-U00, LXK2-PW14-V00 LXK2-PM12-R00, LXK2-PM12-S00, LXK2-PM14-U00 LXK2-PE12-Q00, LXK2-PE12-R00, LXK2-PE12-S00, LXK2-PE14-T00, LXK2-PE14-U00 LXK2-PB12-K00, LXK2-PB12-L00, LXK2-PB12-M00, LXK2-PB14-N00, LXK2-PB14-P00, LXK2-PB14-Q00 LXK2-PR12-L00, LXK2-PR12-M00, LXK2-PR14-Q00, LXK2-PR14-R00 LXK2-PD12-Q00, LXK2-PD12-R00, LXK2-PD12-S00 LXK2-PH12-R00, LXK2-PH12-S00 LXK2-PL12-P00, LXK2-PL12-Q00, LXK2-PL12-R00 Source: www.luxeon.com KINGBRIGHT: KA-3528ASYC Source: www.kingbright.com; MOUSER: 710-156120RS75300
LED201 = led:LED: LED OSRAM: - CHIPLED LG R971, LG N971, LY N971, LG Q971, LY Q971, LO R971, LY R971 LH N974, LH R974 LS Q976, LO Q976, LY Q976 LO Q996 - Hyper CHIPLED LW Q18S LB Q993, LB Q99A, LB R99A - SideLED LS A670, LO A670, LY A670, LG A670, LP A670 LB A673, LV A673, LT A673, LW A673 LH A674 LY A675 LS A676, LA A676, LO A676, LY A676, LW A676 LS A679, LY A679, LG A679 - Hyper Micro SIDELED® LS Y876, LA Y876, LO Y876, LY Y876 LT Y87S - SmartLED LW L88C, LW L88S LB L89C, LB L89S, LG L890 LS L89K, LO L89K, LY L89K LS L896, LA L896, LO L896, LY L896 - TOPLED LS T670, LO T670, LY T670, LG T670, LP T670 LSG T670, LSP T670, LSY T670, LOP T670, LYG T670 LG T671, LOG T671, LSG T671 LB T673, LV T673, LT T673, LW T673 LH T674 LS T676, LA T676, LO T676, LY T676, LB T676, LH T676, LSB T676, LW T676 LB T67C, LV T67C, LT T67C, LS T67K, LO T67K, LY T67K, LW E67C LS E67B, LA E67B, LO E67B, LY E67B, LB E67C, LV E67C, LT E67C LW T67C LS T679, LY T679, LG T679 LS T770, LO T770, LY T770, LG T770, LP T770 LB T773, LV T773, LT T773, LW T773 LH T774 LS E675, LA E675, LY E675, LS T675 LS T776, LA T776, LO T776, LY T776, LB T776 LHGB T686 LT T68C, LB T68C - Hyper Mini TOPLED® LB M676 - Mini TOPLED Santana® LG M470 LS M47K, LO M47K, LY M47K Source: http://www.osram.convergy.de LUXEON: - LUMILED® LXK2-PW12-R00, LXK2-PW12-S00, LXK2-PW14-U00, LXK2-PW14-V00 LXK2-PM12-R00, LXK2-PM12-S00, LXK2-PM14-U00 LXK2-PE12-Q00, LXK2-PE12-R00, LXK2-PE12-S00, LXK2-PE14-T00, LXK2-PE14-U00 LXK2-PB12-K00, LXK2-PB12-L00, LXK2-PB12-M00, LXK2-PB14-N00, LXK2-PB14-P00, LXK2-PB14-Q00 LXK2-PR12-L00, LXK2-PR12-M00, LXK2-PR14-Q00, LXK2-PR14-R00 LXK2-PD12-Q00, LXK2-PD12-R00, LXK2-PD12-S00 LXK2-PH12-R00, LXK2-PH12-S00 LXK2-PL12-P00, LXK2-PL12-Q00, LXK2-PL12-R00 Source: www.luxeon.com KINGBRIGHT: KA-3528ASYC Source: www.kingbright.com; MOUSER: 710-156120YS75300
LED301-LED307 = led:LED: LED OSRAM: - CHIPLED LG R971, LG N971, LY N971, LG Q971, LY Q971, LO R971, LY R971 LH N974, LH R974 LS Q976, LO Q976, LY Q976 LO Q996 - Hyper CHIPLED LW Q18S LB Q993, LB Q99A, LB R99A - SideLED LS A670, LO A670, LY A670, LG A670, LP A670 LB A673, LV A673, LT A673, LW A673 LH A674 LY A675 LS A676, LA A676, LO A676, LY A676, LW A676 LS A679, LY A679, LG A679 - Hyper Micro SIDELED® LS Y876, LA Y876, LO Y876, LY Y876 LT Y87S - SmartLED LW L88C, LW L88S LB L89C, LB L89S, LG L890 LS L89K, LO L89K, LY L89K LS L896, LA L896, LO L896, LY L896 - TOPLED LS T670, LO T670, LY T670, LG T670, LP T670 LSG T670, LSP T670, LSY T670, LOP T670, LYG T670 LG T671, LOG T671, LSG T671 LB T673, LV T673, LT T673, LW T673 LH T674 LS T676, LA T676, LO T676, LY T676, LB T676, LH T676, LSB T676, LW T676 LB T67C, LV T67C, LT T67C, LS T67K, LO T67K, LY T67K, LW E67C LS E67B, LA E67B, LO E67B, LY E67B, LB E67C, LV E67C, LT E67C LW T67C LS T679, LY T679, LG T679 LS T770, LO T770, LY T770, LG T770, LP T770 LB T773, LV T773, LT T773, LW T773 LH T774 LS E675, LA E675, LY E675, LS T675 LS T776, LA T776, LO T776, LY T776, LB T776 LHGB T686 LT T68C, LB T68C - Hyper Mini TOPLED® LB M676 - Mini TOPLED Santana® LG M470 LS M47K, LO M47K, LY M47K Source: http://www.osram.convergy.de LUXEON: - LUMILED® LXK2-PW12-R00, LXK2-PW12-S00, LXK2-PW14-U00, LXK2-PW14-V00 LXK2-PM12-R00, LXK2-PM12-S00, LXK2-PM14-U00 LXK2-PE12-Q00, LXK2-PE12-R00, LXK2-PE12-S00, LXK2-PE14-T00, LXK2-PE14-U00 LXK2-PB12-K00, LXK2-PB12-L00, LXK2-PB12-M00, LXK2-PB14-N00, LXK2-PB14-P00, LXK2-PB14-Q00 LXK2-PR12-L00, LXK2-PR12-M00, LXK2-PR14-Q00, LXK2-PR14-R00 LXK2-PD12-Q00, LXK2-PD12-R00, LXK2-PD12-S00 LXK2-PH12-R00, LXK2-PH12-S00 LXK2-PL12-P00, LXK2-PL12-Q00, LXK2-PL12-R00 Source: www.luxeon.com KINGBRIGHT: KA-3528ASYC Source: www.kingbright.com; MOUSER: 710-156120VS75300
Q301 = crystal:CRYSTAL: CRYSTAL; MOUSER: 815-ABL-3.6864-B2; OC_FARNELL: 1667008; OC_NEWARK: unknown
QG101 = crystal:XO-: CRYSTAL; MOUSER: 774-MXO45HS-3C-8.0; MOUSER_SOCKET: 535-1108800; OC_FARNELL: unknown; OC_NEWARK: unknown
R101 R102 R201 R304-R310 = rcl:R-EU_: RESISTOR, European symbol; MOUSER: 652-CR0805JW-302ELF; SPICEPREFIX: R
R103-R122 R303 R311-R314 R401 R403 R404 = rcl:R-EU_: RESISTOR, European symbol; MOUSER: 652-CR0805FX-1002ELF; SPICEPREFIX: R
R301 R302 = rcl:R-EU_: RESISTOR, European symbol; MOUSER: 652-CR0805FX-1000ELF; SPICEPREFIX: R
R402 = rcl:R-EU_: RESISTOR, European symbol; MOUSER: 652-CR0805JW-101ELF; SPICEPREFIX: R
S301 = switch-dil:DIP04S: DIL/CODE SWITCH; MOUSER: 653-A6FR-4104; OC_FARNELL: unknown; OC_NEWARK: unknown
S401 = switch-omron:31-XX: OMRON SWITCH; MOUSER: 653-B3F-3150; MPN: B3F-3100; OC_FARNELL: 959704; OC_NEWARK: 36M3582; SPICEPREFIX: S
S402 = switch-omron:31-XX: OMRON SWITCH; MOUSER: 653-B3F-3150; MPN: B3F-3100; OC_FARNELL: 959704; OC_NEWARK: 36M3582
SJ301-SJ304 = jumper:SJ2W: SMD solder JUMPER
SV101 = con-harting-ml:ML64: HARTING; OC_FARNELL: unknown; OC_NEWARK: unknown
SV301 = con-lstb:MA06-1: PIN HEADER; OC_FARNELL: unknown; OC_NEWARK: unknown
X301 = con-subd:F09HP: SUB-D; MOUSER: 806-K22X-E9P-N-99; OC_FARNELL: unknown; OC_NEWARK: unknown

## Net classes
0 default: width 0.203 mm